# EAGLE design wt41_breakout_board_v10 (EAGLE 5.11)
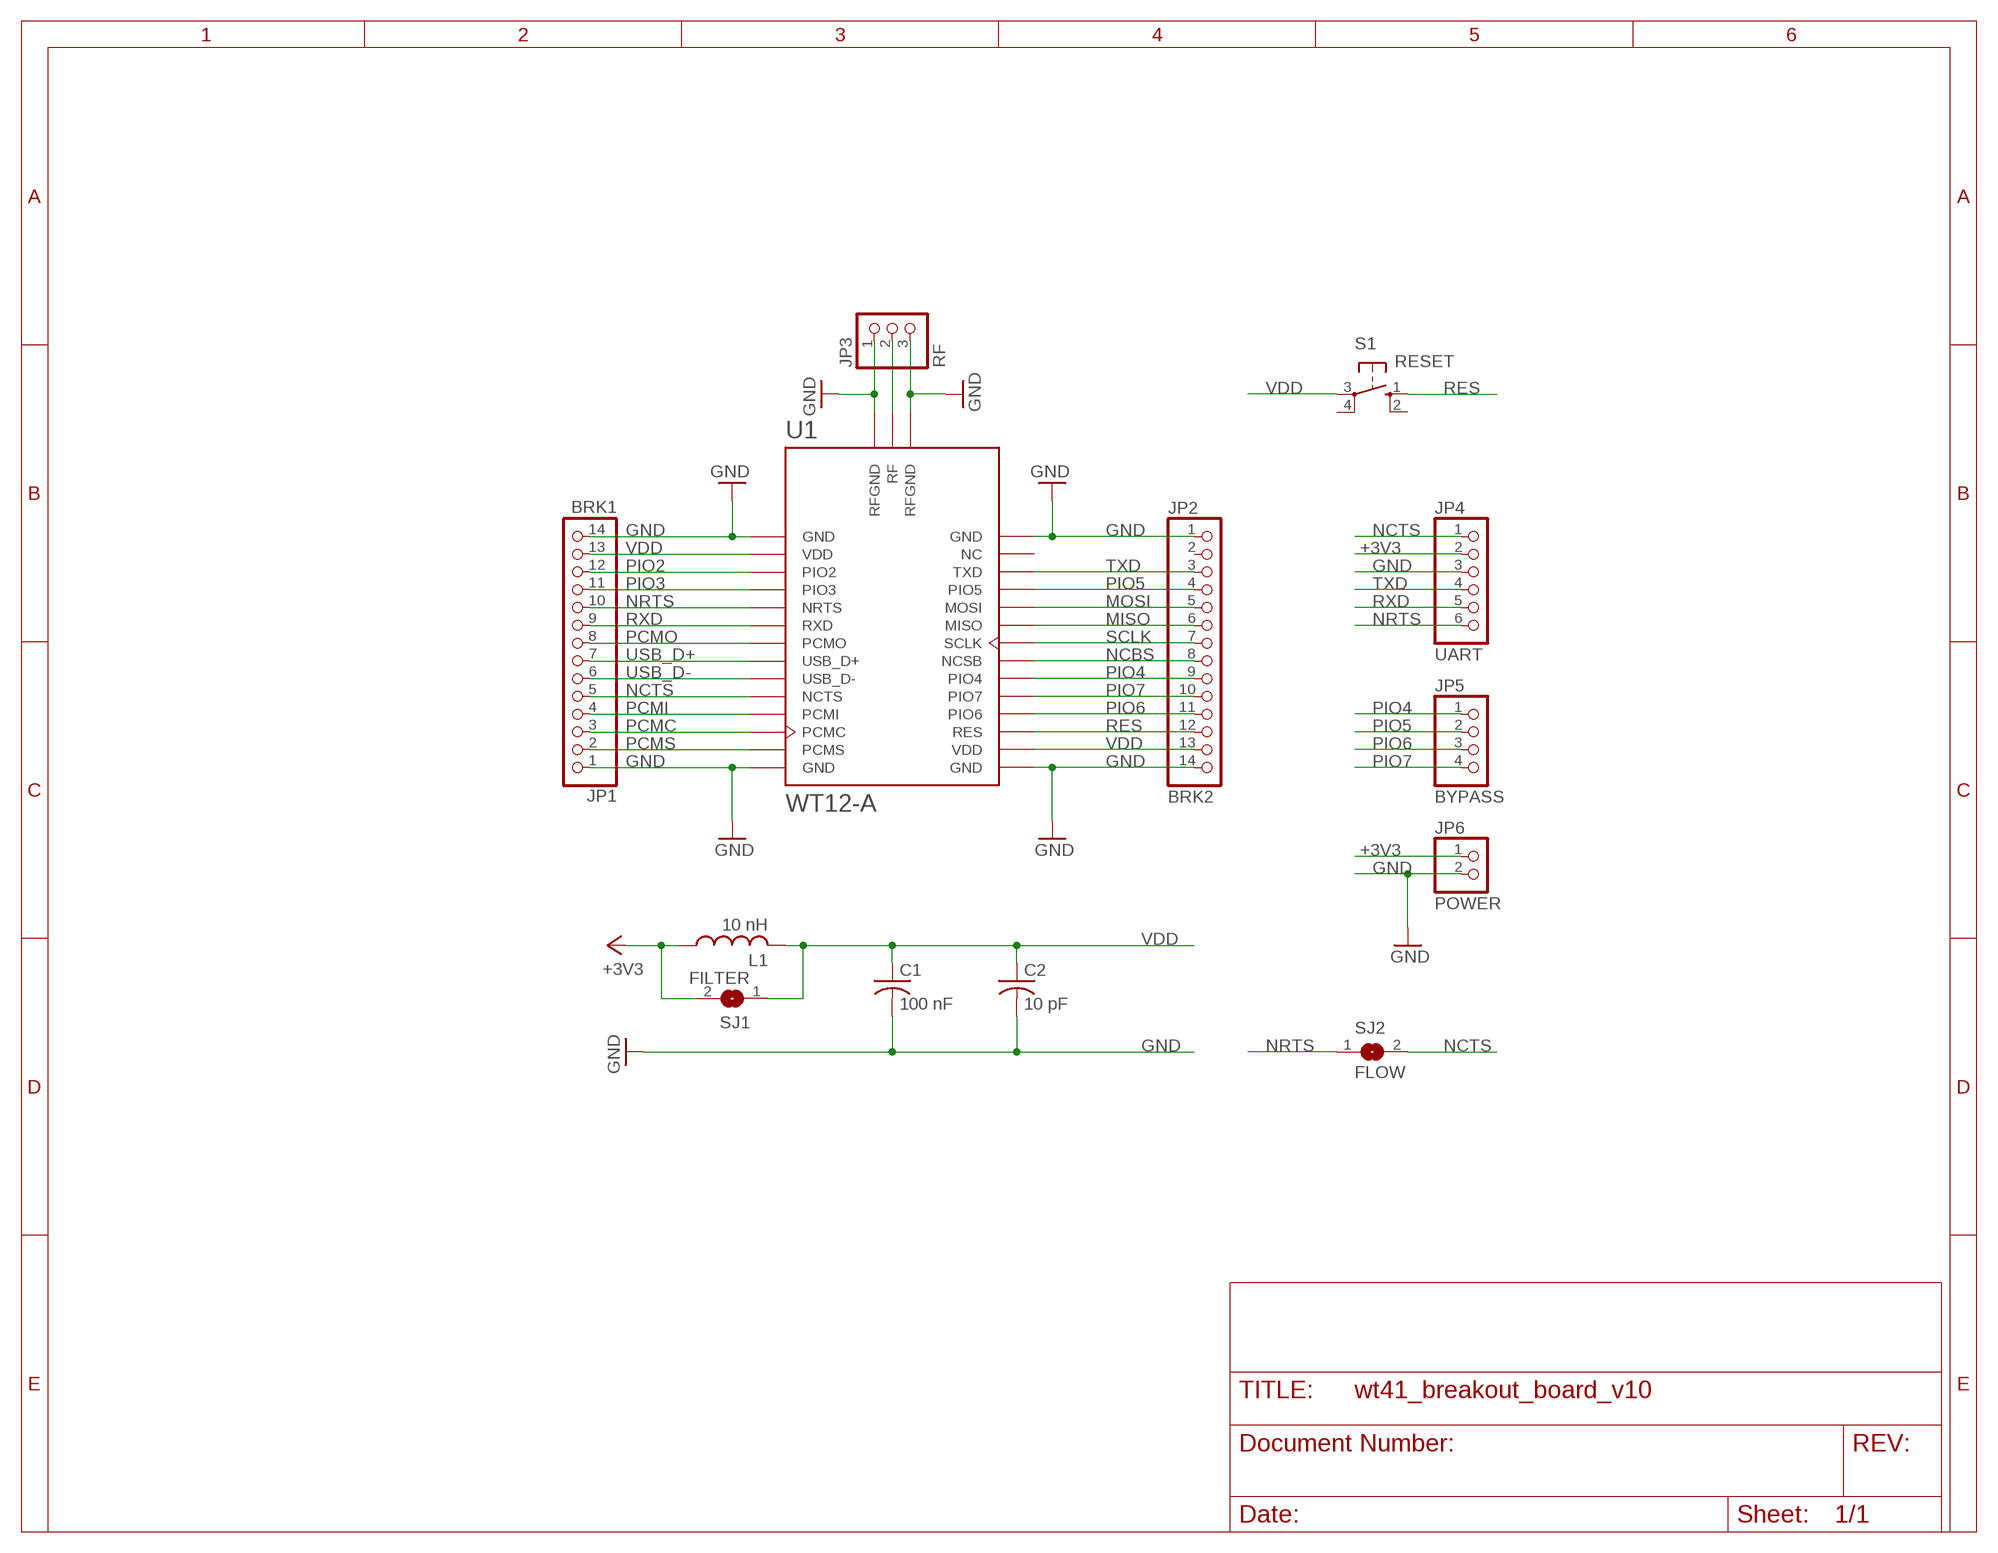
[diagram p0: schematic, sheet 1]

## Parts
C1  100 nF  C-US025-025X050  [C025-025X050]
C2  10 pF  C-US025-025X050  [C025-025X050]
JP1  BRK1  PINHD-1X14  [1X14]
JP2  BRK2  PINHD-1X14  [1X14]
JP3  RF  PINHD-1X3  [1X03]
JP4  UART  PINHD-1X6  [1X06]
JP5  BYPASS  PINHD-1X4  [1X04]
JP6  POWER  PINHD-1X2  [1X02]
L1  10 nH  L-US0204/7  [0204/7]
S1  RESET  10-XX  [B3F-10XX]
SJ1  FILTER  SJ  [SJ]
SJ2  FLOW  SJ  [SJ]
U1  WT12-A  WT12-A-VISUAL  [WT12-A]

## Nets
+3V3: JP4.2 JP6.1 L1.1 SJ1.2
GND: C1.2 C2.2 JP1.1 JP1.14 JP2.1 JP2.14 JP3.1 JP3.3 JP4.3 JP6.2 U1.GND1(GND) U1.GND2(GND) U1.GND3(GND) U1.GND4(GND) U1.RFGND1(RFGND) U1.RFGND2(RFGND)
MISO: JP2.6 U1.MISO
MOSI: JP2.5 U1.MOSI
NCBS: JP2.8 U1.NCSB
NCTS: JP1.5 JP4.1 SJ2.2 U1.NCTS
NRTS: JP1.10 JP4.6 SJ2.1 U1.NRTS
PCMC: JP1.3 U1.PCMC
PCMI: JP1.4 U1.PCMI
PCMO: JP1.8 U1.PCMO
PCMS: JP1.2 U1.PCMS
PIO2: JP1.12 U1.PIO2
PIO3: JP1.11 U1.PIO3
PIO4: JP2.9 JP5.1 U1.PIO4
PIO5: JP2.4 JP5.2 U1.PIO5
PIO6: JP2.11 JP5.3 U1.PIO6
PIO7: JP2.10 JP5.4 U1.PIO7
RES: JP2.12 S1.1(S) U1.RES
RF: JP3.2 U1.RF
RXD: JP1.9 JP4.5 U1.RXD
SCLK: JP2.7 U1.SCLK
TXD: JP2.3 JP4.4 U1.TXD
USB_D+: JP1.7 U1.USB_D+
USB_D-: JP1.6 U1.USB_D-
VDD: C1.1 C2.1 JP1.13 JP2.13 L1.2 S1.3(P) SJ1.1 U1.VDD1(VDD) U1.VDD2(VDD)
Unconnected: JP2.2 S1.2(S1) S1.4(P1) U1.NC

## Library data of the parts
C1 C2 = resistor:C-US: CAPACITOR, American symbol
JP1 JP2 = sf-pinhead:PINHD-1X14: PIN HEADER
JP3 = sf-pinhead:PINHD-1X3: PIN HEADER
JP4 = sf-pinhead:PINHD-1X6: PIN HEADER
JP5 = sf-pinhead:PINHD-1X4: PIN HEADER
JP6 = sf-pinhead:PINHD-1X2: PIN HEADER
L1 = resistor:L-US: INDUCTOR, American symbol
S1 = switch-omron:10-XX: OMRON SWITCH; MPN: B3F-1000; OC_FARNELL: 176432; OC_NEWARK: 36M3542
SJ1 SJ2 = jumper:SJ: SMD solder JUMPER
U1 = sf-bluegiga:WT12-A-VISUAL: Class 2 Bluetooth 2.1 + EDR module, chip antenna and RF pins

## Net classes
0 default: width 0.254 mm, drill 0.508 mm, clearance 0.254 mm

## Board
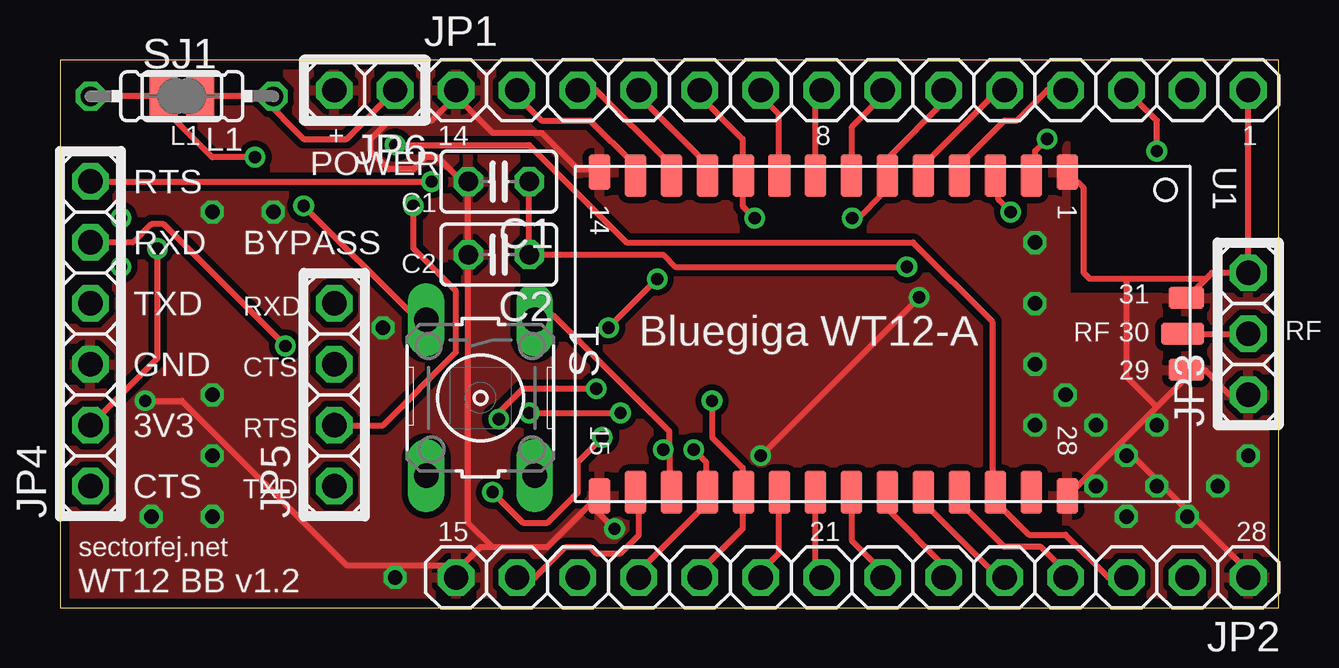
[diagram p1: board, top side]
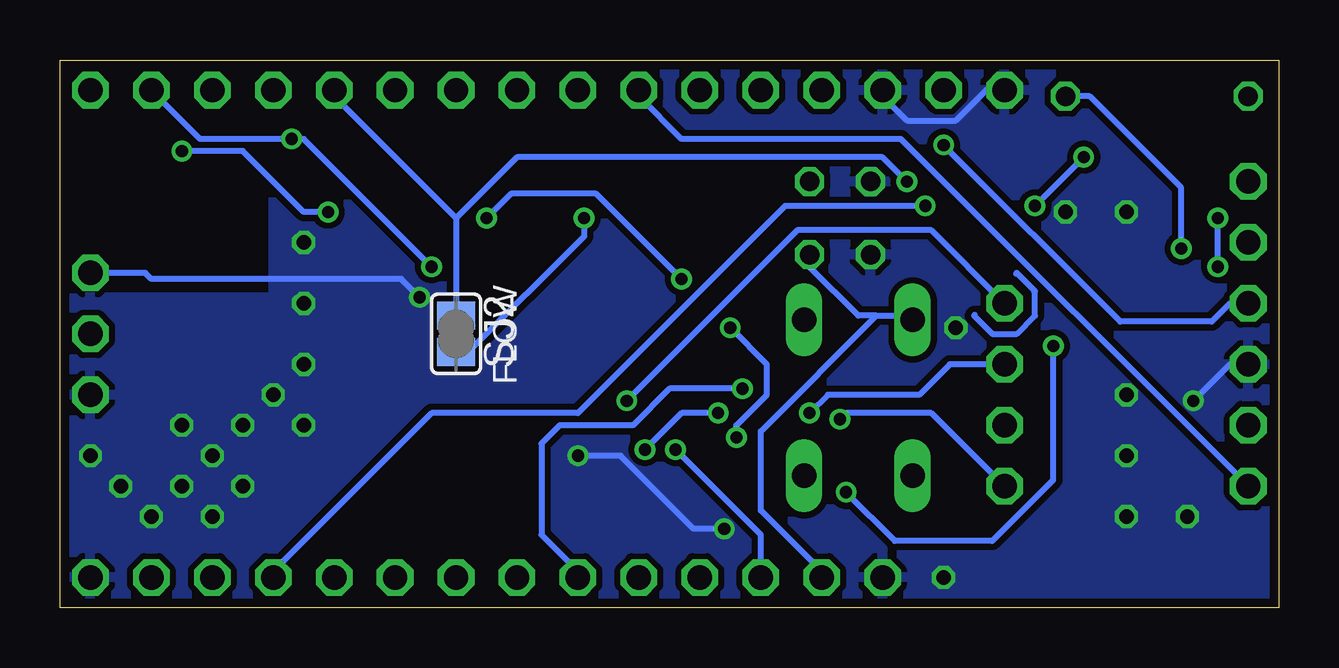
[diagram p2: board, bottom side, seen from below]

Size 50.8 x 22.85 mm. Coordinates in mm from the lower left corner, seen from the top.
Outline: 0,0 50.8,0 50.8,22.85 0,22.85 0,0
Copper layers (1*16): Top 0.0356mm / dielectric 1.5011mm / Bottom 0.0356mm
Design rules "LaenPCBOrder": minimum track width 6mil, minimum drill 13mil, track to track 6mil, track to pad 6mil, pad to pad 6mil, via to via 6mil, smd to smd 6mil, copper to edge 15mil, drill to drill 6mil, minimum pad ring 7mil, minimum via ring 7mil, stop-mask expansion 4mil, vias tented up to drill 0mil, thermal gap 10mil
tRestrict: area 42.9,14 to 47,18.4
bRestrict: area 42.9,14 to 47,18.4

### Footprints (pad centres in the part's own frame; a part is rotated, then mirrored left to right if it is on the bottom)
C025-025X050 = drill 0.813 octagon: 1 -1.27,0; 2 1.27,0
1X14 = drill 1.016 octagon: 1 -16.51,0; 2 -13.97,0; 3 -11.43,0; 4 -8.89,0; 5 -6.35,0; 6 -3.81,0; 7 -1.27,0; 8 1.27,0; 9 3.81,0; 10 6.35,0; 11 8.89,0; 12 11.43,0; 13 13.97,0; 14 16.51,0
1X03 = drill 1.016 octagon: 1 -2.54,0; 2 0,0; 3 2.54,0
1X06 = drill 1.016 octagon: 1 -6.35,0; 2 -3.81,0; 3 -1.27,0; 4 1.27,0; 5 3.81,0; 6 6.35,0
1X04 = drill 1.016 octagon: 1 -3.81,0; 2 -1.27,0; 3 1.27,0; 4 3.81,0
1X02 = drill 1.016 octagon: 1 -1.27,0; 2 1.27,0
0204/7 = drill 0.813 octagon: 1 -3.81,0; 2 3.81,0
B3F-10XX = drill 1.016 long: 1 -3.251,2.261; 2 3.251,2.261; 3 -3.251,-2.261; 4 3.251,-2.261
SJ = smd 1.168 x 1.6: 1 -0.762,0; 2 0.762,0
WT12-A = smd 1.478 x 0.914: GND1 -6.75,7.7; GND2 -6.75,-11.8; GND3 6.75,-11.8; GND4 6.75,7.7 | smd 1.778 x 0.914: MISO 6.6,0.2; MOSI 6.6,1.7; NC 6.6,6.2; NCSB 6.6,-2.8; NCTS -6.6,-5.8; NRTS -6.6,1.7; PCMC -6.6,-8.8; PCMI -6.6,-7.3; PCMO -6.6,-1.3; PCMS -6.6,-10.3; PIO2 -6.6,4.7; PIO3 -6.6,3.2; PIO4 6.6,-4.3; PIO5 6.6,3.2; PIO6 6.6,-7.3; PIO7 6.6,-5.8; RES 6.6,-8.8; RXD -6.6,0.2; SCLK 6.6,-1.3; TXD 6.6,4.7; USB_D+ -6.6,-2.8; USB_D- -6.6,-4.3; VDD1 -6.6,6.2; VDD2 6.6,-10.3 | smd 0.914 x 1.778: RF 0,12.5 | smd 0.914 x 1.478: RFGND1 1.5,12.65; RFGND2 -1.5,12.65

### Placement (x,y rotation side)
C1  18.29,17.78 180 top
C2  18.29,14.73 180 top
JP1  33.02,21.59 0 top
JP2  33.02,1.27 180 top
JP3  49.53,11.43 90 top
JP4  1.27,11.43 90 top
JP5  11.43,8.89 90 top
JP6  12.7,21.59 180 top
L1  5.08,21.34 180 top
S1  17.53,8.76 270 top
SJ1  5.08,21.34 0 top
SJ2  34.29,11.43 270 bottom
U1  34.29,11.43 270 top

### Tracks (layer width: path | path; a pad name or v marks a point on that pad's centre or on a via)
+3V3  (via drill 0.51)
  Top 0.254: 8.38,21.34 SJ1.2 | JP4.2 4.06,10.41 v4.06,14.99 | JP6.1 11.94,19.56 10.16,19.56 8.38,21.34 | L1.1 8.38,21.34
  Bottom 0.254: v4.06,14.99 4.06,17.53 7.87,21.34 L1.1
GND  (via drill 0.51, 0.6)
  Top 0.254: 45.72,8.38 46.74,9.4 46.74,9.91 U1.RFGND1 46.99,9.91 47.75,9.91 48.77,8.89 JP3.1 | 45.72,8.38 44.2,6.86 | 44.2,6.86 42.16,4.83 U1.GND4 | JP2.1 49.53,1.52 44.2,6.86 | 47.75,13.72 48.01,13.97 JP3.3 JP1.14 | 47.75,13.72 46.99,12.95 U1.RFGND2 | 47.75,13.72 44.45,13.72 | 44.45,13.72 42.93,13.72 42.67,13.97 42.67,17.53 42.16,18.03 U1.GND1 | 45.72,8.38 44.45,9.65 44.45,13.72 | 16.51,21.34 18.03,19.81 20.07,19.81 21.59,18.29 22.35,18.29 U1.GND2 | 17.02,17.53 C2.2 17.02,3.56 18.03,2.54 | 22.1,4.32 20.32,2.54 18.03,2.54 | 22.1,4.32 22.35,4.57 U1.GND3 22.1,4.32 | 18.03,2.54 17.53,2.54 16.76,1.78 | 16.76,1.78 16.51,1.52 JP2.14 16.76,1.78 | v3.56,8.64 5.08,8.64 11.94,1.78 16.76,1.78 | 16.51,21.34 15.49,20.32 13.72,20.32 12.95,19.56 12.95,19.05 13.72,18.29 14.73,18.29 15.24,18.8 15.75,18.8 17.02,17.53 | 16.51,21.34 JP1.1 | 17.02,17.53 C1.2 | v29.21,6.35 v35.81,12.95 | 22.1,4.32 v23.11,3.3
  Bottom 0.254: JP6.2 12.19,21.59 13.46,20.32 15.49,20.32 16.51,21.34 JP1.1 | JP4.3 2.03,10.16 v3.56,8.64 | JP3.3 47.24,13.97 46.99,13.72 36.58,13.72 v35.81,12.95 | v29.21,6.35 27.43,6.35 24.38,3.3 v23.11,3.3
  other vias: 6.35,16.51 8.89,16.51 6.35,8.89 6.35,6.35 6.35,3.81 3.81,3.81 13.97,1.27 13.46,11.68 40.64,15.24 40.64,12.7 40.64,10.16 41.91,8.89 40.64,7.62 43.18,7.62 45.72,7.62 44.45,6.35 45.72,5.08 43.18,5.08 44.45,3.81 46.99,3.81 48.26,5.08 49.53,6.35
  pour Bottom: 0,22.86 41.91,22.86 41.91,12.95 50.8,12.95 50.8,0 0,0
  pour Top: 0,22.86 41.91,22.86 41.91,12.95 50.8,12.95 50.8,0 0,0
GNDA  (via drill 0.51)
  Bottom 0.254: v2.54,14.22 v2.54,16.26
GNDB
  Bottom 0.254: 10.16,13.21 10.92,13.97 10.95,13.94 | 10.16,13.21 10.19,13.18 | 10.16,13.21 10.16,12.19 10.92,11.43 11.94,11.43 12.7,12.19 12.67,12.22
MISO
  Top 0.254: JP2.6 36.83,1.78 34.54,4.06 34.54,4.83 U1.MISO
MOSI
  Top 0.254: JP2.5 39.12,1.27 36.07,4.32 36.07,4.83 U1.MOSI
NCBS
  Top 0.254: JP2.8 31.5,1.52 U1.NCSB
NCTS  (via drill 0.51)
  Top 0.254: v28.96,16.26 28.45,16.76 28.45,17.78 U1.NCTS 28.45,18.03 28.45,19.56 26.67,21.34 JP1.5
  Bottom 0.254: SJ2.2 33.78,10.67 28.96,15.49 v28.96,16.26 | JP4.1 15.75,19.56 24.89,19.56 26.67,21.34 JP1.5
NRTS  (via drill 0.51)
  Top 0.254: JP1.10 39.12,21.59 36.07,18.54 36.07,18.03 U1.NRTS | JP4.6 v15.49,17.78
  Bottom 0.254: 34.29,16.26 SJ2.1 | 34.29,16.26 39.37,21.34 JP1.10 | v15.49,17.78 16.51,18.8 31.75,18.8 34.29,16.26
PCMC
  Top 0.254: JP1.3 22.35,21.59 25.4,18.54 25.4,18.03 U1.PCMC
PCMI
  Top 0.254: JP1.4 24.13,21.34 26.92,18.54 26.92,18.03 U1.PCMI
PCMO
  Top 0.254: JP1.8 34.29,21.34 33.02,20.07 33.02,18.03 U1.PCMO
PCMS
  Top 0.254: JP1.2 19.05,21.34 20.07,20.32 22.1,20.32 23.88,18.54 23.88,18.03 U1.PCMS
PIO2  (via drill 0.51)
  Top 0.254: v39.62,16.51 39.12,17.02 39.12,17.78 U1.PIO2 | v45.72,19.05 45.72,20.32 JP1.12
  Bottom 0.254: v39.62,16.51 40.64,16.51 43.18,19.05 v45.72,19.05
PIO3
  Top 0.254: JP1.11 41.15,21.59 39.88,20.32 39.37,20.32 37.59,18.54 37.59,18.03 U1.PIO3
PIO4  (via drill 0.51)
  Top 0.254: JP2.9 29.21,1.52 29.97,2.29 29.97,4.83 U1.PIO4 | v18.29,7.87 18.29,8.13 19.3,9.14 v22.35,9.14
  Bottom 0.254: JP5.1 14.48,8.13 18.03,8.13 v18.29,7.87 | v22.35,9.14 25.4,9.14 26.92,7.62 29.97,7.62 30.73,6.86 30.73,3.05 29.21,1.52 JP2.9
PIO5  (via drill 0.51)
  Top 0.254: JP2.4 41.91,1.52 40.89,2.54 39.37,2.54 37.59,4.32 37.59,4.83 U1.PIO5 | JP5.2 13.46,7.62 16.51,10.67 16.51,13.21 14.73,14.99 v14.73,16.76
  Bottom 0.254: v14.73,16.76 20.57,16.76 29.21,8.13 35.31,8.13 41.91,1.52 JP2.4
PIO6  (via drill 0.51)
  Top 0.254: JP2.11 24.13,1.52 26.92,4.32 26.92,4.83 U1.PIO6 26.92,5.08 26.92,6.1 v26.42,6.6 | v19.56,8.13 v23.37,8.13
  Bottom 0.254: JP5.3 13.72,10.16 14.99,8.89 18.8,8.89 v19.56,8.13 | v23.37,8.13 24.89,8.13 v26.42,6.6
PIO7  (via drill 0.51)
  Top 0.254: JP2.10 26.67,1.52 28.45,3.3 28.45,4.83 U1.PIO7 28.45,5.08 28.45,5.84 27.18,7.11 v27.18,8.64
  Bottom 0.254: JP5.4 14.48,15.75 20.07,15.75 v27.18,8.64
RES  (via drill 0.51)
  Top 0.254: 25.4,6.6 25.4,7.37 20.57,12.19 19.81,12.19 S1.1 | 25.4,6.6 25.4,5.08 U1.RES | v25.15,6.6 25.4,6.6
  Bottom 0.254: JP2.12 21.59,3.05 v25.15,6.6
RF
  Top 0.254: U1.RF JP3.2
RXD  (via drill 0.51)
  Top 0.254: JP1.9 36.83,21.08 34.54,18.8 34.54,18.03 U1.RXD 34.29,17.78 34.29,17.27 33.27,16.26 v33.02,16.26 | JP4.5 3.05,15.24 3.81,16 4.32,16 v9.4,10.92 | v18.03,4.83 19.3,3.56 20.32,3.56 21.59,4.83 21.59,6.1 v22.61,7.11 | v22.86,11.68 v24.89,13.72
  Bottom 0.254: v9.4,10.92 9.4,5.33 11.94,2.79 16,2.79 v18.03,4.83 | v22.61,7.11 22.61,7.62 21.34,8.89 21.34,10.16 v22.86,11.68 | v24.89,13.72 28.45,17.27 32,17.27 v33.02,16.26
SCLK
  Top 0.254: JP2.7 34.29,1.52 33.02,2.79 33.02,4.83 U1.SCLK
TXD  (via drill 0.51)
  Top 0.254: JP2.3 43.69,1.27 41.91,3.05 40.39,3.05 39.12,4.32 39.12,4.83 U1.TXD 38.86,5.08 38.86,11.94 35.56,15.24 23.62,15.24 19.56,19.3 v13.97,19.3
  Bottom 0.254: JP4.4 2.03,12.7 2.79,11.94 6.6,11.94 v13.97,19.3
USB_D+
  Top 0.254: JP1.7 31.5,21.34 U1.USB_D+
USB_D-
  Top 0.254: JP1.6 29.21,21.34 29.97,20.57 29.97,18.03 U1.USB_D-
VDD  (via drill 0.51)
  Top 0.254: v41.15,19.56 40.64,19.05 40.64,18.03 U1.VDD1 | JP2.13 19.81,1.27 21.08,2.54 22.1,2.54 22.35,2.29 23.37,2.29 24.13,3.05 24.13,4.83 U1.VDD2 | L1.2 SJ1.1 4.32,20.83 6.35,18.8 v8.13,18.8 | C1.1 C2.1 25.15,14.73 25.65,14.22 v35.31,14.22 | v10.16,16.76 14.73,12.19 15.24,12.19 S1.3
  Bottom 0.254: JP1.13 44.96,19.56 v41.15,19.56 40.64,19.56 v35.31,14.22 | 16.76,12.19 17.53,12.19 19.56,14.22 C2.1 | 16.76,12.19 15.49,12.19 S1.3 | v10.16,16.76 v8.13,18.8 | JP2.13 19.05,1.52 21.59,4.06 21.59,7.37 16.76,12.19

### Text on the board
tPlace: L1 | + | - | 14 | 8 | 1 | POWER | RTS | C1 | RXD | BYPASS | C2 | TXD | RXD | Bluegiga WT12-A | RF | GND | CTS | 3V3 | RTS | CTS | TXD | 15 | 21 | 28 | sectorfej.net | WT12 BB v1.2
bPlace: FLOW